# Altium schematic sheet Sheet2.SchDoc
size A4; SheetNumber: 1; SheetTotal: 1
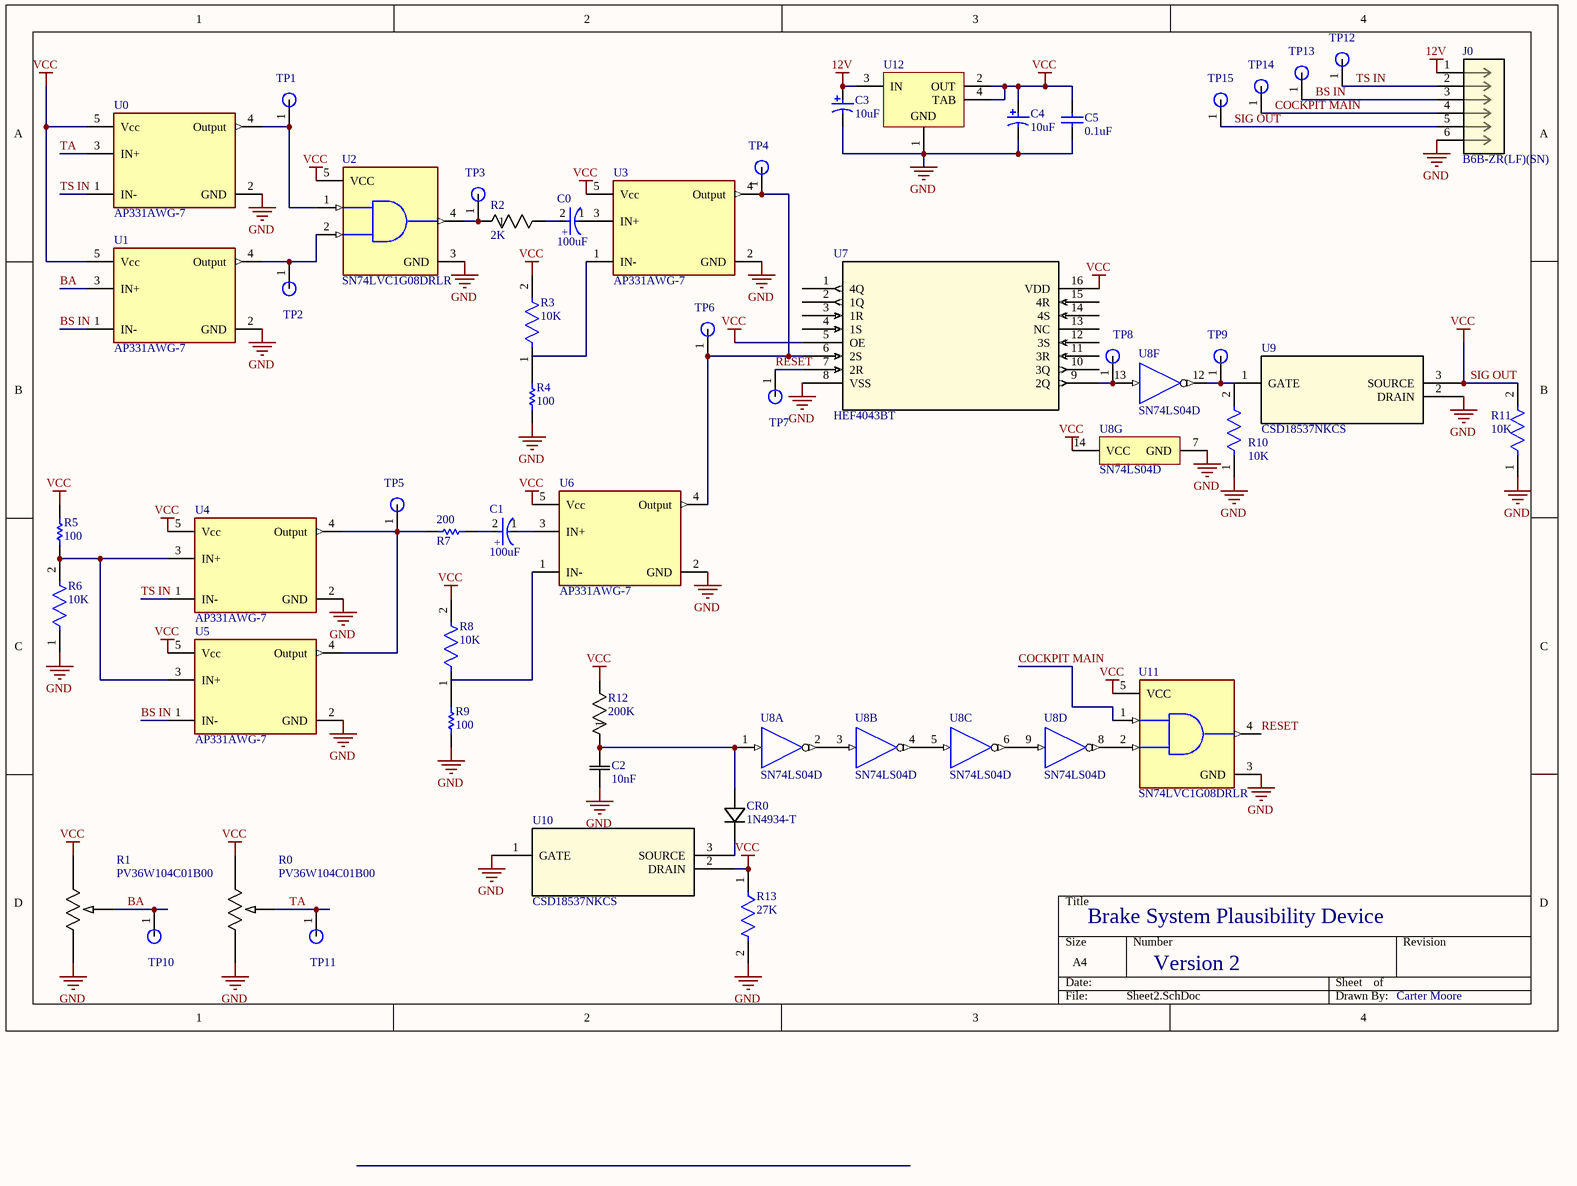
[diagram p0: Sheet2.SchDoc]

## Parts
200  R7  [RESC0603X28X15ML05T05]
C0  100uF  [FP-MAL2150-1010-MFG]
C1  100uF  [FP-MAL2150-1010-MFG]
C2  10nF  [CAP_C317C_MR_X7R_KEM]
C3  10uF  [PNSC-EEU-EE2G100-2_V]
C4  10uF  [PNSC-EEU-EE2G100-2_V]
C5  0.1uF  [AVX-SA115C104KAR]
CR0  1N4934-T  [DO-41_DIO]
J0  B6B-ZR(LF)(SN)  [CONN_B6B-ZR_JST]
R0  PV36W104C01B00  [POT_PV36W_BRN]
R1  PV36W104C01B00  [POT_PV36W_BRN]
R2  2K  [YAG_MF25_YAG]
R3  10K  [FP-MF0207-MFG]
R4  100  [RESA60-630X240]
R5  100  [RESA60-630X240]
R6  10K  [FP-MF0207-MFG]
R8  10K  [FP-MF0207-MFG]
R9  100  [RESA60-630X240]
R10  10K  [FP-MF0207-MFG]
R11  10K  [FP-MF0207-MFG]
R12  200K  [YAG_MF25_YAG]
R13  27K  [FP-RT0402-MFG]
TP1  Test Point  [TP1]  (value not drawn)  (no BOM)
TP2  Test Point  [TP1]  (value not drawn)  (no BOM)
TP3  Test Point  [TP1]  (value not drawn)  (no BOM)
TP4  Test Point  [TP1]  (value not drawn)  (no BOM)
TP5  Test Point  [TP1]  (value not drawn)  (no BOM)
TP6  Test Point  [TP1]  (value not drawn)  (no BOM)
TP7  Test Point  [TP1]  (value not drawn)  (no BOM)
TP8  Test Point  [TP1]  (value not drawn)  (no BOM)
TP9  Test Point  [TP1]  (value not drawn)  (no BOM)
TP10  Test Point  [TP1]  (value not drawn)  (no BOM)
TP11  Test Point  [TP1]  (value not drawn)  (no BOM)
TP12  Test Point  [TP1]  (value not drawn)  (no BOM)
TP13  Test Point  [TP1]  (value not drawn)  (no BOM)
TP14  Test Point  [TP1]  (value not drawn)  (no BOM)
TP15  Test Point  [TP1]  (value not drawn)  (no BOM)
U0  AP331AWG-7  [FP-SOT25-MFG]
U1  AP331AWG-7  [FP-SOT25-MFG]
U2  SN74LVC1G08DRLR  [FP-DRL0005A-MFG]
U3  AP331AWG-7  [FP-SOT25-MFG]
U4  AP331AWG-7  [FP-SOT25-MFG]
U5  AP331AWG-7  [FP-SOT25-MFG]
U6  AP331AWG-7  [FP-SOT25-MFG]
U7  HEF4043BT  [SOT109-1_NXP]
U8  SN74LS04D  [D0014A_N]  (parts A,B,C,D,F,G of 7)
U9  CSD18537NKCS  [KCS3_TEX]
U10  CSD18537NKCS  [KCS3_TEX]
U11  SN74LVC1G08DRLR  [FP-DRL0005A-MFG]
U12  LM1117MPX-5.0/NOPB  [DCY0004A_L]  (value not drawn)

## Nets
12V: C3.1 J0.1 U12.3(IN)
GND: C2.1 C3.2 C4.2 C5.1 J0.6 R0.3 R1.3 R4.1 R6.1 R9.1 R10.1 R11.1 R13.2 U0.2(GND) U1.2(GND) U2.3(GND) U3.2(GND) U4.2(GND) U5.2(GND) U6.2(GND) U7.8(VSS) U8.7(GND) U9.2(DRAIN) U10.1(GATE) U11.3(GND) U12.1(GND)
SIG OUT: C4.1 C5.2 J0.5 R0.1 R1.1 R3.2 R5.2 R8.2 R11.2 R12.2 R13.1 TP15.1 U0.5(Vcc) U1.5(Vcc) U2.5(VCC) U3.5(Vcc) U4.5(Vcc) U5.5(Vcc) U6.5(Vcc) U7.5(OE) U7.16(VDD) U8.14(VCC) U9.3(SOURCE) U10.2(DRAIN) U11.5(VCC) U12.2(OUT) U12.4(TAB)  [also labelled VCC]
BA: R1.2 TP10.1 U1.3(IN+)
BS IN: J0.3 TP13.1 U1.1(IN-) U5.1(IN-)
COCKPIT MAIN: J0.4 TP14.1 U11.1(A)
RESET: TP7.1 U7.7(2R) U11.4(Y)
TA: R0.2 TP11.1 U0.3(IN+)
TS IN: J0.2 TP12.1 U0.1(IN-) U4.1(IN-)
Net200_1: 200.1 TP5.1 U4.4(Output) U5.4(Output)
Net200_2: 200.2 C1.2(A)
NetC0_1: C0.1(C) U3.3(IN+)
NetC0_2: C0.2(A) R2.2
NetC1_1: C1.1(C) U6.3(IN+)
NetC2_2: C2.2 CR0.2 R12.1 U8.1(1A)
NetCR0_1: CR0.1 U10.3(SOURCE)
NetR2_1: R2.1 TP3.1 U2.4(Y)
NetR3_1: R3.1 R4.2
NetR5_1: R5.1 R6.2 U4.3(IN+) U5.3(IN+)
NetR8_1: R8.1 R9.2
NetR10_2: R10.2 TP9.1 U8.12(~{6Y}) U9.1(GATE)
NetTP1_1: TP1.1 U0.4(Output) U2.1(A)
NetTP2_1: TP2.1 U1.4(Output) U2.2(B)
NetTP4_1: TP4.1 TP6.1 U3.4(Output) U6.4(Output) U7.6(2S)
NetTP8_1: TP8.1 U7.9(2Q) U8.13(6A)
NetU8_2: U8.2(~{1Y}) U8.3(2A)
NetU8_4: U8.4(~{2Y}) U8.5(3A)
NetU8_6: U8.6(~{3Y}) U8.9(4A)
NetU8_8: U8.8(~{4Y}) U11.2(B)

Not connected (* = marked no-connect by the designer): U3 1(IN-); U6 1(IN-); U7 1(4Q) 2(1Q) 3(1R) 4(1S) 10(3Q) 11(3R) 12(3S) 13(NC) 14(4S) 15(4R)

## Notes on the sheet
- Brake System Plausibility Device
- Version 2
- Carter Moore
- (in symbol 203bc49f2ac43e59fd269a8c329ed05) +

## Library data of the parts
200 = RES: Manufacturer: Vishay Dale; Part Number: CRCW0201200RJNED
C0 C1 = 203bc49f2ac43e59fd269a8c329ed05: CAP ALUM 100UF 20% 50V SMD; Impedance: 240mR; Dissipation Factor: 0.12%; Ripple Current (AC): 490mA; Dielectric Material: Aluminium; Life (Hours): 3000Hour; Voltage Rating (DC): 50V; Capacitance: 100uF; Voltage Rating: 50V; Max Operating Temperature: 105°C; Width: 10mm; Construction: Cylindrical; ESR (Equivalent Series Resistance): 240mR; Radiation Hardening: No; Length: 10mm; Case/Package: Radial; Packaging: Tape and Reel; Min Operating Temperature: -55°C; Package Quantity: 500; RoHS Compliant: Yes; Series: Automotive, AEC-Q200, 150 CRZ; Ripple Current: 490mA; Height: 10mm; Tolerance: 20%; Diameter: 10mm; Termination: SMD/SMT
C2 = C317C103K5R5TA: CAP CER 10000PF 50V X7R RADIAL; Mfr_Name: Kemet; Type: DEV; Copyright: Copyright (C) 2023 Ultra Librarian. All rights reserved.; Manufacturer_Part_Number: C317C103K5R5TA; Digi-Key_Part_Number_1: 399-4206-ND; RefDes: RefDes
C3 C4 = CMP-0736-00002-1: Aluminum Electrolytic Capacitor, 10 uF +/- 20%, 400 V, -25 to 105 degC, 2-Pin 10 x 10 x 22 mm Through-hole, RoHS, Tape and Reel; PartNumber: EEU-EE2G100; Manufacturer: Panasonic; Ripple Current: 430 mA; Rated Voltage: 400 V; Capacitance Tolerance: +/- 20%; ComponentLink2URL: http://industrial.panasonic.com/www-data/pdf/ABA0000/ABA0000CE113.pdf; Mounting Technology: Through Hole; PackageVersion: Nov-12; ComponentLink3URL: http://industrial.panasonic.com/www-data/pdf/ABA0000/ABA0000PE245.pdf; ComponentLink2Description: Datasheet; DatasheetVersion: Nov-12; PackageDescription: 2-Pin Through-hole, Base 10 x 10 mm, Height 22 mm; PackageReference: EEU-EE2G100-2; ComponentLink1URL: http://industrial.panasonic.com/; Temp. Range: -25 to 105 degC; RoHS: TRUE; Packing: Tape and Reel; Cap.: 10 uF; ComponentLink1Description: Manufacturer URL; ComponentLink3Description: Package Specification
C5 = CMP-2000-07029-1: Axial Leads / SpinGuard(R), Ceramic Capacitor, 0.10 uF +/- 10%, 50V, -55 to 125 degC, 2-Pin THD, RoHS, Tape and Reel; Manufacturer: AVX; Other Names: 478-3151-1; Catalog Drawings: SASeries_4.32x3.05; Capacitance: 0.1µF; Temperature Coefficient: X7R; Online Catalog: SpinGuard®SASeries; Product Training Modules: ComponentSolutionsforSmartMeterApplications; Category: Capacitors; Package Description: 2-Pin Axial Lead, Dia 3.05 mm, Body Length 4.32 mm; Standard Package: 1; Mounting Technology: ThroughHole; Ratings: -; Datasheet Version: 06/2007; Voltage - Rated: 50V; Tolerance: ±10%; Package Reference: SA115C104KAR; Packaging: -; Lead Style: -; Size / Dimension: 0.120"Diax0.170"L(3.05mmx4.32mm); Mounting Type: ThroughHole; Operating Temperature: -55°C~125°C; Datasheet URL: https://datasheet.ciiva.com/27051/1074183-27051369.pdf; Applications: GeneralPurpose; Thickness (Max): -; Lead Spacing: -; Height - Seated (Max): -; Family: CeramicCapacitors; Package / Case: Axial; Features: -; Series: SpinGuard®SA; Manufacturer URL: http://www.avx.com/
CR0 = 1N4934-T: No Description Available; Mfr_Name: Diodes Inc; Type: DEV; Copyright: Copyright (C) 2023 Ultra Librarian. All rights reserved.; Manufacturer_Part_Number: 1N4934-T; Digi-Key_Part_Number_1: 1N4934DICT-ND; Digi-Key_Part_Number_2: 1N4934DITR-ND; RefDes: RefDes
J0 = B6B-ZRLFSN: CONN HEADER VERT 6POS 1.5MM; Mfr_Name: JST; Copyright: Copyright (C) 2023 Ultra Librarian. All rights reserved.; Manufacturer_Part_Number: B6B-ZR(LF)(SN); Digi-Key_Part_Number_1: 455-1661-ND; RefDes: RefDes; Type: DEV
R0 R1 = PV36W104C01B00: TRIMMER 100K OHM 0.5W PC PIN TOP; Mfr_Name: Bourns Electronics; Type: Trimmer Potentiometers; Digi-Key_Part_Number_1: 490-2876-ND
R2 = MFR-25FRF52-2K: No Description Available; Mfr_Name: Yageo; Copyright: Copyright (C) 2023 Ultra Librarian. All rights reserved.; Manufacturer_Part_Number: MFR-25FRF52-2K; Digi-Key_Part_Number_1: 2.00KXTR-ND; RefDes: RefDes; Type: DEV
R3 R8 = CMP-03413-000006-1: RES 10K OHM 1% 0.6W AXIAL; Temperature Coefficient: 50ppm/°C; Resistance: 10kR; Mount: Through Hole; Radiation Hardening: No; Tolerance: 1%; Construction: Cylindrical; Contact Plating: Tin; Case/Package: Conformal; Resistor Type: Metal Film; Min Operating Temperature: -55°C; Military Standard: Not; Lead Free: Lead Free; Diameter: 2.4mm; Termination: Axial; Max Operating Temperature: 155°C; RoHS Compliant: Yes; Packaging: Ammo Pack; Length: 6.3mm
R4 R9 = CMP-1659-00071-1: Axial Resistor, 100 Ohm, +/- 1%, 0.25 W, -55 to 155 degC, 2-Pin THD, RoHS, Bulk; Voltage Rating: 250 V; Resistance: 4.75 kohm; Power Rating: 250 mW; Type (Resistor): Metal Film; Package Quantity: 200; RoHSCompliant: true; ComponentLink1URL: http://www.yageo.com/; ComponentLink1Description: Manufacturer URL; Case\Package: Axial; ComponentLink2Description: Datasheet; Length: 0.248 inch; PackageReference: MFR-25; Max Operating Temperature: 155 degC; Min Operating Temperature: -55 degC; DatasheetVersion: Apr-13; Mount: Through Hole; PackageDescription: 2-Pin Axial Lead, Dia 2.4 mm, Body Length 6.3 mm; Packaging: Bulk; Tolerance: 1%; ComponentLink2URL: http://www.yageo.com/documents/recent/Yageo%20LR_MFR_2013.pdf
R5 = RES-2: Axial Resistor, 100 Ohm, +/- 1%, 0.25 W, -55 to 155 degC, 2-Pin THD, RoHS, Bulk; Voltage Rating: 250 V; Resistance: 4.75 kohm; Power Rating: 250 mW; Type (Resistor): Metal Film; Package Quantity: 200; RoHSCompliant: true; ComponentLink1URL: http://www.yageo.com/; ComponentLink1Description: Manufacturer URL; Case\Package: Axial; ComponentLink2Description: Datasheet; Length: 0.248 inch; PackageReference: MFR-25; Max Operating Temperature: 155 degC; Min Operating Temperature: -55 degC; DatasheetVersion: Apr-13; Mount: Through Hole; PackageDescription: 2-Pin Axial Lead, Dia 2.4 mm, Body Length 6.3 mm; Packaging: Bulk; Tolerance: 1%; ComponentLink2URL: http://www.yageo.com/documents/recent/Yageo%20LR_MFR_2013.pdf
R6 R10 R11 = 1029c3af85768c4190bb7ad29bc67b5: RES 10K OHM 1% 0.6W AXIAL; Temperature Coefficient: 50ppm/°C; Resistance: 10kR; Mount: Through Hole; Radiation Hardening: No; Tolerance: 1%; Construction: Cylindrical; Contact Plating: Tin; Case/Package: Conformal; Resistor Type: Metal Film; Min Operating Temperature: -55°C; Military Standard: Not; Lead Free: Lead Free; Diameter: 2.4mm; Termination: Axial; Max Operating Temperature: 155°C; RoHS Compliant: Yes; Packaging: Ammo Pack; Length: 6.3mm
R12 = MFR-25FRF52-200K: RES 200K OHM 1% 1/4W AXIAL; Mfr_Name: Yageo; Copyright: Copyright (C) 2023 Ultra Librarian. All rights reserved.; Manufacturer_Part_Number: MFR-25FRF52-200K; Digi-Key_Part_Number_1: 200KXTR-ND; RefDes: RefDes; Type: DEV
R13 = CMP-03412-006683-1: RES SMD 27K OHM 0.5% 1/16W 0402; Manufacturer: Yageo; Manufacturer Part Number: RT0402DRE0727KL; Temperature Coefficient: 50 ppm/°C; Power Rating: 0.063W; Voltage Rating: 50V; Tolerance: 0.005; Resistance: 27KΩ; Value: 27KΩ; Temperature: -55°C to +155°C; ComponentLink2Description: Datasheet; Footprint Url: http://www.yageo.com/exep/pages/download/literatures/PYu-R_Mount_10.pdf; Composition: Thin Film; Device Class L1: Passive Components; Octopart: https://octopart.com/rt0402dre0727kl-yageo-1275250; Device Class L2: Resistors; ComponentLink2URL: http://www.yageo.com/documents/recent/PYu-RT_1-to-0.01_RoHS_L_9.pdf; Category: Res; Temperature Range Low: -55°C; Temperature Range High: +155°C; Series: RT; RoHS: TRUE; Package: RT0402; Lead Free: Yes; Digikey Description: RES SMD 27K OHM 0.5% 1/16W 0402; Device Class L3: Chip SMD Resistors; Automotive: No; Height: 0.35mm; Ipc Land Pattern Name: RESC10050X30
U0 U1 U3-U6 = 84157f6d693ce6938d681314262b7f3: IC COMPARATOR SGL DIFF SOT-25; Manufacturer: Diodes Inc.; Standoff Height: 0.013mm; Min Dual Supply Voltage: 1V; Input Offset Voltage: 4mV; Min Supply Voltage: 2V; Output Current Per Channel: 16mA; Number Of Channels: 1; Voltage Gain: 200V/mV; Max Supply Voltage: 36V; Input Bias Current: 0.15uA; Max Junction Temp: +150°C; Nominal Supply Current: 0.4-1mA; Max Dual Supply Voltage: 18V; Response Time: 300ns; Category: IC; Temperature Range High: +70°C; Automotive: No; Lead Free: Yes; Digikey Description: IC COMPARATOR SGL DIFF SOT-25; Ambient Temperature Range Low: 0°C; Octopart: https://octopart.com/ap331awg-7-diodes+inc.-12688108; Manufacturer Part Number: AP331AWG-7; Device Class L2: Linear ICs; RoHS: TRUE; Package: SOT25; ComponentLink2Description: Datasheet; Temperature: 0°C to +70°C; Height: 1.4mm; Device Class L3: Comparators; Temperature Range Low: 0°C; ComponentLink2URL: https://www.diodes.com/assets/Datasheets/AP331A.pdf; Device Class L1: Integrated Circuits (ICs); Mouser Description: Analog Comparators 2V-36V 2.5mA 2V-36V 2.5mA; Ambient Temperature Range High: +70°C; Footprint Url: https://www.diodes.com/assets/Package-Files/SOT25.pdf
U2 U11 = cbd873ac6525a059c6951788f409ef0: IC GATE AND 1CH 2-INP SOT5; Manufacturer: Texas Instruments; Number Of Inputs: 2; Nominal Supply Current: 10uA; Max Junction Temp: +150°C; Max Supply Voltage: 5.5V; Number Of Circuits: 1; Min Supply Voltage: 1.65V; Propagation Delay: 5ns; Standoff Height: 0mm; ComponentLink2Description: Datasheet; Device Class L1: Integrated Circuits (ICs); Temperature: -40°C to +125°C; Ambient Temperature Range Low: -40°C; Digikey Description: IC GATE AND 1CH 2-INP SOT5; RoHS: TRUE; Device Class L2: Logic ICs; Height: 0.6mm; Logic Function Desc: AND; Package: DRL0005A; Manufacturer Part Number: SN74LVC1G08DRLR; Lead Free: Yes; Category: IC; ComponentLink2URL: http://www.ti.com/lit/ds/symlink/sn74lvc1g08.pdf; Mouser Description: Logic Gates Sngl 2 Inpt Pos AND Gate; Octopart: https://octopart.com/sn74lvc1g08drlr-texas+instruments-464956; Device Class L3: Logic Gates; Number Of Outputs: 1; Automotive: No; Ambient Temperature Range High: +125°C; Temperature Range High: +125°C; Temperature Range Low: -40°C
U7 = HEF4043BT: IC R/S LATCH 3-STATE QUAD 16SOIC; Mfr_Name: NXP; Copyright: Copyright (C) 2023 Ultra Librarian. All rights reserved.; Manufacturer_Part_Number: HEF4043BT; Digi-Key_Part_Number_1: 568-11395-2-ND; Digi-Key_Part_Number_2: 568-11395-1-ND; Digi-Key_Part_Number_3: 568-11395-6-ND; Digi-Key_Part_Number_4: 568-11333-5-ND; RefDes: RefDes; Type: DEV
U8 = TI-CD_SNX4XXXXXX4X_19A-14: Hex inverters, D0014A, TUBE; Manufacturer: Texas Instruments; Schmitt Trigger: No; Input Type: TTL; Bits(#): 6; Voltage(Nom)(V): 5; VCC(Max)(V): 5.25; Output Drive (IOL/IOH)(Max)(mA): -0.4/8; Technology Family: LS; tpd @ Nom Voltage(Max)(ns): 22; Output Type: CMOS; F @ Nom Voltage(Max)(Mhz): 35; Rating: Catalog; VCC(Min)(V): 4.75; ICC @ Nom Voltage(Max)(mA): 0.033; Generic Part Number: SN74LS04; DatasheetVersion: SDLS029C; PackageReference: D0014A; Code_JEDEC: MS-012; Operating Temperature Range(C): 0 to 70
U9 U10 = CSD18537NKCS: No Description Available; Mfr_Name: Texas Instruments; Copyright: Copyright (C) 2023 Ultra Librarian. All rights reserved.; Manufacturer_Part_Number: CSD18537NKCS; Digi-Key_Part_Number_1: 296-36456-5-ND; Digi-Key_Part_Number_2: 296-36456-5-NDR; Digi-Key_Part_Number_3: 296-CSD18537NKCS-ND; RefDes: RefDes; Type: DEV
U12 = CMP-0062-01635-4: 800mA Low-Dropout Linear Regulator, 4-pin SOT-223, Pb-Free; Manufacturer: Texas Instruments; PowerWise: N; High-Reliability: Y; PackageTopMarking: XYTT*N06A; CompType: LDO IC; PartNumber: LM1117MPX-5.0/NOPB; Code_JEDEC: TO-261-AA; Code_IPC: SOT223-4; ComponentLink1URL: http://www.ti.com/general/docs/lit/getliterature.tsp?genericPartNumber=LM1117-N&fileType=pdf; PinCount: 4; PackageReference: DCY0004A; ComponentLink1Description: Datasheet URL; PackageDescription: Molded SOT-223, 6.50 x 3.56 x 1.6mm Body, 4 Lead, 2.3mm Pitch; RoHS: Y